# Altium schematic sheet 18.RK3568_VO Interface_2.SchDoc
size 297 x 209 mm
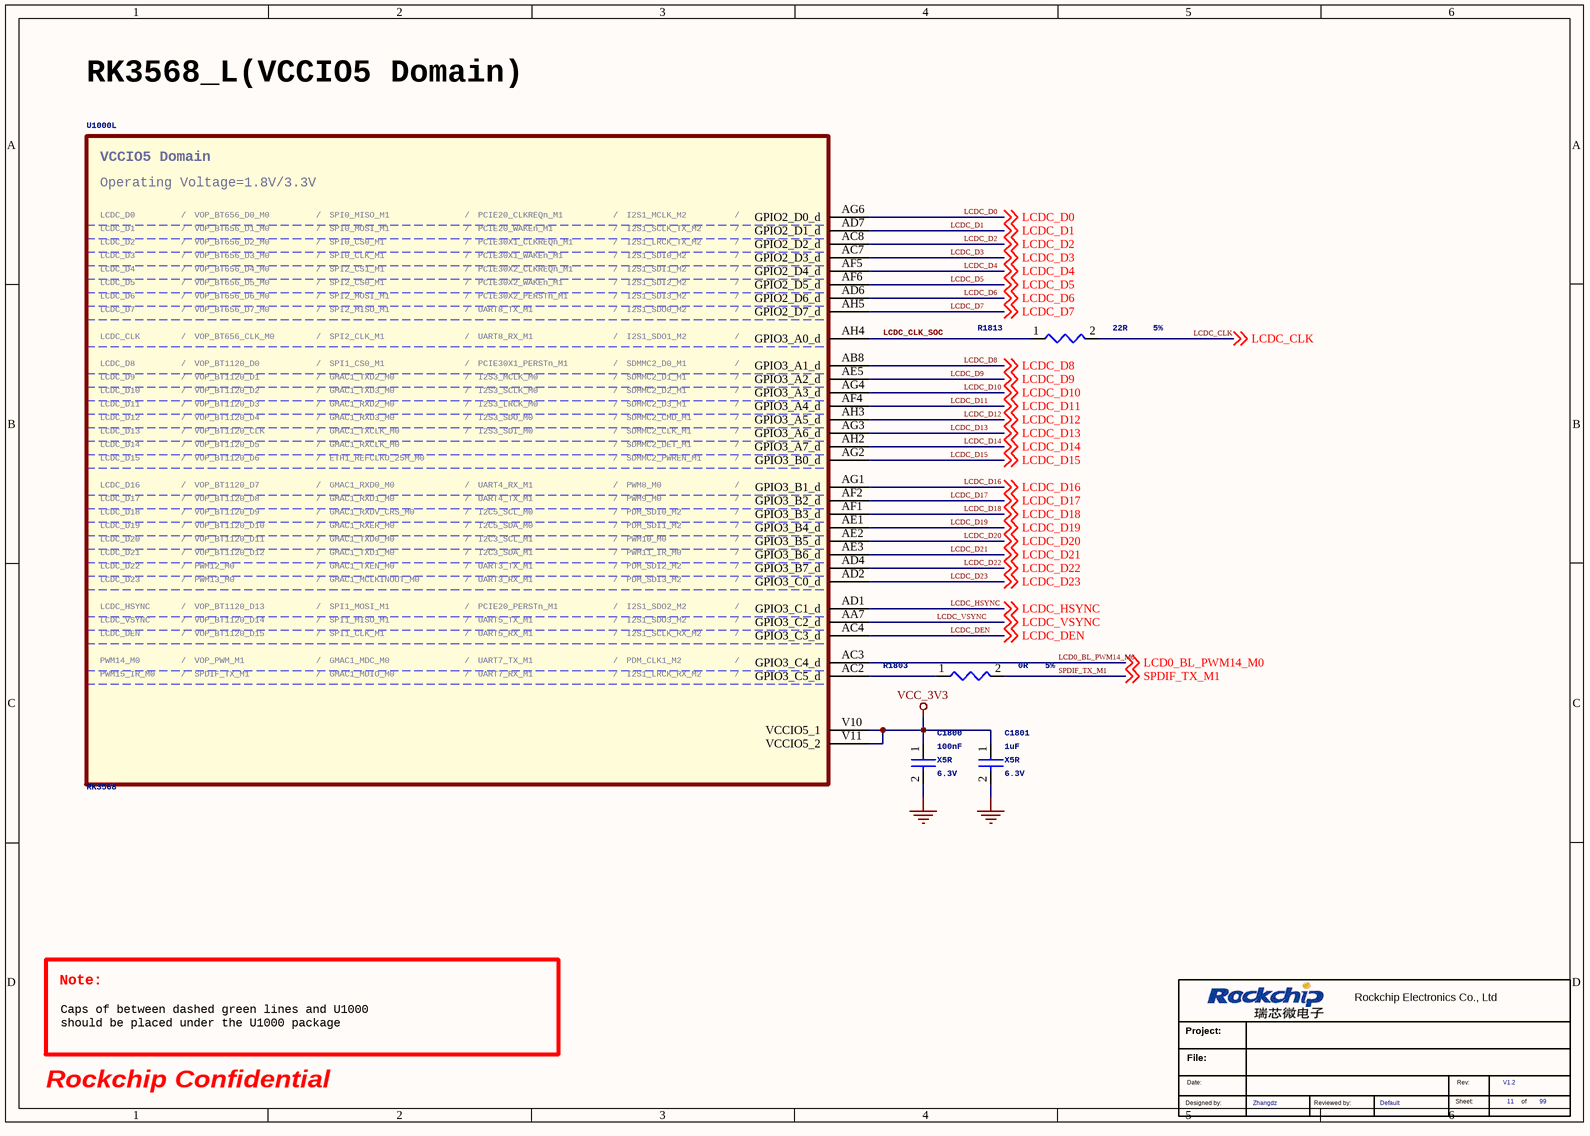
[diagram p0: 18.RK3568_VO Interface_2.SchDoc]

## Parts
*  Schematic Page Count: 99  Schematic Page Number: 11  Designer: Zhangdz  Revision: V1.2  Check: Default  (hidden comment: Rockchip_new)  (graphical)
C1800  100nF  Voltage: 6.3V  Dielectric: X5R  [C0201]
C1801  1uF  Voltage: 6.3V  Dielectric: X5R  [C0402]
R1803  0R  Tolerance: 5%  [R0402]
R1813  22R  Tolerance: 5%  [R0402]
U1000  RK3568  [BGA636_19R00X19R00X1R20]  (part L of 23)

## Nets
GND: C1800.2 C1801.2
VCC_3V3: C1800.1 C1801.1 U1000.V10(VCCIO5_1) U1000.V11(VCCIO5_2)
LCD0_BL_PWM14_M0: U1000.AC3(GPIO3_C4_d) ; off-sheet LCD0_BL_PWM14_M0
LCDC_CLK: R1813.2 ; off-sheet LCDC_CLK
LCDC_CLK_SOC: R1813.1 U1000.AH4(GPIO3_A0_d)
LCDC_D0: U1000.AG6(GPIO2_D0_d) ; off-sheet LCDC_D0
LCDC_D1: U1000.AD7(GPIO2_D1_d) ; off-sheet LCDC_D1
LCDC_D2: U1000.AC8(GPIO2_D2_d) ; off-sheet LCDC_D2
LCDC_D3: U1000.AC7(GPIO2_D3_d) ; off-sheet LCDC_D3
LCDC_D4: U1000.AF5(GPIO2_D4_d) ; off-sheet LCDC_D4
LCDC_D5: U1000.AF6(GPIO2_D5_d) ; off-sheet LCDC_D5
LCDC_D6: U1000.AD6(GPIO2_D6_d) ; off-sheet LCDC_D6
LCDC_D7: U1000.AH5(GPIO2_D7_d) ; off-sheet LCDC_D7
LCDC_D8: U1000.AB8(GPIO3_A1_d) ; off-sheet LCDC_D8
LCDC_D9: U1000.AE5(GPIO3_A2_d) ; off-sheet LCDC_D9
LCDC_D10: U1000.AG4(GPIO3_A3_d) ; off-sheet LCDC_D10
LCDC_D11: U1000.AF4(GPIO3_A4_d) ; off-sheet LCDC_D11
LCDC_D12: U1000.AH3(GPIO3_A5_d) ; off-sheet LCDC_D12
LCDC_D13: U1000.AG3(GPIO3_A6_d) ; off-sheet LCDC_D13
LCDC_D14: U1000.AH2(GPIO3_A7_d) ; off-sheet LCDC_D14
LCDC_D15: U1000.AG2(GPIO3_B0_d) ; off-sheet LCDC_D15
LCDC_D16: U1000.AG1(GPIO3_B1_d) ; off-sheet LCDC_D16
LCDC_D17: U1000.AF2(GPIO3_B2_d) ; off-sheet LCDC_D17
LCDC_D18: U1000.AF1(GPIO3_B3_d) ; off-sheet LCDC_D18
LCDC_D19: U1000.AE1(GPIO3_B4_d) ; off-sheet LCDC_D19
LCDC_D20: U1000.AE2(GPIO3_B5_d) ; off-sheet LCDC_D20
LCDC_D21: U1000.AE3(GPIO3_B6_d) ; off-sheet LCDC_D21
LCDC_D22: U1000.AD4(GPIO3_B7_d) ; off-sheet LCDC_D22
LCDC_D23: U1000.AD2(GPIO3_C0_d) ; off-sheet LCDC_D23
LCDC_DEN: U1000.AC4(GPIO3_C3_d) ; off-sheet LCDC_DEN
LCDC_HSYNC: U1000.AD1(GPIO3_C1_d) ; off-sheet LCDC_HSYNC
LCDC_VSYNC: U1000.AA7(GPIO3_C2_d) ; off-sheet LCDC_VSYNC
SPDIF_TX_M1: R1803.2 ; off-sheet SPDIF_TX_M1
NetR1803_1: R1803.1 U1000.AC2(GPIO3_C5_d)

## Notes on the sheet
- RK3568_L(VCCIO5 Domain)
- Note:
- Caps of between dashed green lines and U1000
  should be placed under the U1000 package
- Rockchip Confidential
- (in symbol Rockchip_new) Rockchip Electronics Co., Ltd; Project:; File:; Date:; Rev:; Designed by:; Reviewed by:; Sheet:; of
- (in symbol SOC_RK3568, part L) VCCIO5 Domain; Operating Voltage=1.8V/3.3V; LCDC_D0; /; VOP_BT656_D0_M0; SPI0_MISO_M1; PCIE20_CLKREQn_M1; I2S1_MCLK_M2; LCDC_D1; VOP_BT656_D1_M0; SPI0_MOSI_M1; PCIE20_WAKEn_M1; I2S1_SCLK_TX_M2; LCDC_D2; VOP_BT656_D2_M0; SPI0_CS0_M1; PCIE30X1_CLKREQn_M1; I2S1_LRCK_TX_M2; LCDC_D3; VOP_BT656_D3_M0; SPI0_CLK_M1; PCIE30X1_WAKEn_M1; I2S1_SDI0_M2; LCDC_D4; VOP_BT656_D4_M0; SPI2_CS1_M1; PCIE30X2_CLKREQn_M1; I2S1_SDI1_M2; LCDC_D5; VOP_BT656_D5_M0; SPI2_CS0_M1; PCIE30X2_WAKEn_M1; I2S1_SDI2_M2; LCDC_D6; VOP_BT656_D6_M0; SPI2_MOSI_M1; PCIE30X2_PERSTn_M1; I2S1_SDI3_M2; LCDC_D7; VOP_BT656_D7_M0; SPI2_MISO_M1; UART8_TX_M1; I2S1_SDO0_M2; LCDC_CLK; VOP_BT656_CLK_M0; SPI2_CLK_M1; UART8_RX_M1; I2S1_SDO1_M2; LCDC_D8; VOP_BT1120_D0; SPI1_CS0_M1; PCIE30X1_PERSTn_M1; SDMMC2_D0_M1; LCDC_D9; VOP_BT1120_D1; GMAC1_TXD2_M0; I2S3_MCLK_M0; SDMMC2_D1_M1; LCDC_D10; VOP_BT1120_D2; GMAC1_TXD3_M0; I2S3_SCLK_M0; SDMMC2_D2_M1; LCDC_D11; VOP_BT1120_D3; GMAC1_RXD2_M0; I2S3_LRCK_M0; SDMMC2_D3_M1; LCDC_D12; VOP_BT1120_D4; GMAC1_RXD3_M0; I2S3_SDO_M0; SDMMC2_CMD_M1; LCDC_D13; VOP_BT1120_CLK; GMAC1_TXCLK_M0; I2S3_SDI_M0; SDMMC2_CLK_M1; LCDC_D14; VOP_BT1120_D5; GMAC1_RXCLK_M0; SDMMC2_DET_M1; LCDC_D15; VOP_BT1120_D6; ETH1_REFCLKO_25M_M0; SDMMC2_PWREN_M1; LCDC_D16; VOP_BT1120_D7; GMAC1_RXD0_M0; UART4_RX_M1; PWM8_M0; LCDC_D17; VOP_BT1120_D8; GMAC1_RXD1_M0; UART4_TX_M1; PWM9_M0; LCDC_D18; VOP_BT1120_D9; GMAC1_RXDV_CRS_M0; I2C5_SCL_M0; PDM_SDI0_M2; LCDC_D19; VOP_BT1120_D10; GMAC1_RXER_M0; I2C5_SDA_M0; PDM_SDI1_M2; LCDC_D20; VOP_BT1120_D11; GMAC1_TXD0_M0; I2C3_SCL_M1; PWM10_M0; LCDC_D21; VOP_BT1120_D12; GMAC1_TXD1_M0; I2C3_SDA_M1; PWM11_IR_M0; LCDC_D22; PWM12_M0; GMAC1_TXEN_M0; UART3_TX_M1; PDM_SDI2_M2; LCDC_D23; PWM13_M0; GMAC1_MCLKINOUT_M0; UART3_RX_M1; PDM_SDI3_M2; LCDC_HSYNC; VOP_BT1120_D13; SPI1_MOSI_M1; PCIE20_PERSTn_M1; I2S1_SDO2_M2; LCDC_VSYNC; VOP_BT1120_D14; SPI1_MISO_M1; UART5_TX_M1; I2S1_SDO3_M2; LCDC_DEN; VOP_BT1120_D15; SPI1_CLK_M1; UART5_RX_M1; I2S1_SCLK_RX_M2; PWM14_M0; VOP_PWM_M1; GMAC1_MDC_M0; UART7_TX_M1; PDM_CLK1_M2; PWM15_IR_M0; SPDIF_TX_M1; GMAC1_MDIO_M0; UART7_RX_M1; I2S1_LRCK_RX_M2

## Library data of the parts
* = Rockchip_new: Page Count: 37; Page Number: 15; Revcode: V1.2
C1800 = CAP NP: cap,100.00nF,+/-10%,6.3V,X5R,C0201; Manufacturer: TDK; RK PN: C0603X5R0J104K030BC; Priority: A; Tolerance: 10%; Part Type: C0201; Manufacturer PN: C0603X5R0J104K030BC; Created by: JJJ
C1801 = CAP NP: cap,1.00uF,+/-10%,6.3V,X5R,C0402; Manufacturer PN: C1005X5R0J105K050BB; Manufacturer: TDK; Tolerance: 10%; Priority: A; Created by: JJJ; Part Type: C0402; RK PN: C1005X5R0J105K050BB
R1803 = RESISTOR: 通用厚膜电阻,0R,+/-5%,R0402,1/16W.; Manufacturer PN: RC0402JR-070RL; Manufacturer: YAGEO; Wattage: 1/16W; Priority: A; Created by: YTL; Part Type: 通用厚膜电阻; RK PN: RC0402JR-070RL
R1813 = RESISTOR: 通用厚膜电阻,22R,+/-5%,R0402,1/16W.; Manufacturer: YAGEO; RK PN: RC0402JR-0722RL; Priority: A; Wattage: 1/16W; Part Type: 通用厚膜电阻; Manufacturer PN: RC0402JR-0722RL; Created by: YTL
U1000 = SOC_RK3568: ROCKCHIP SOC; Manufacturer: Rockchip (瑞芯微); SPLIT_INST: TRUE; SWAP_INFO: (S1+S2+S3+S4+S5+S6+S7+S8+S9+S10+S11+S12+S13+S14+S15+S16+S17+S18+S19+S20+S21+S22+S23); Priority: A; Created by: JJJ; Manufacturer PN: RK3568; Part Type: SOC; RK PN: RK3568